# EAGLE design usb-helper (EAGLE 7.4.0)
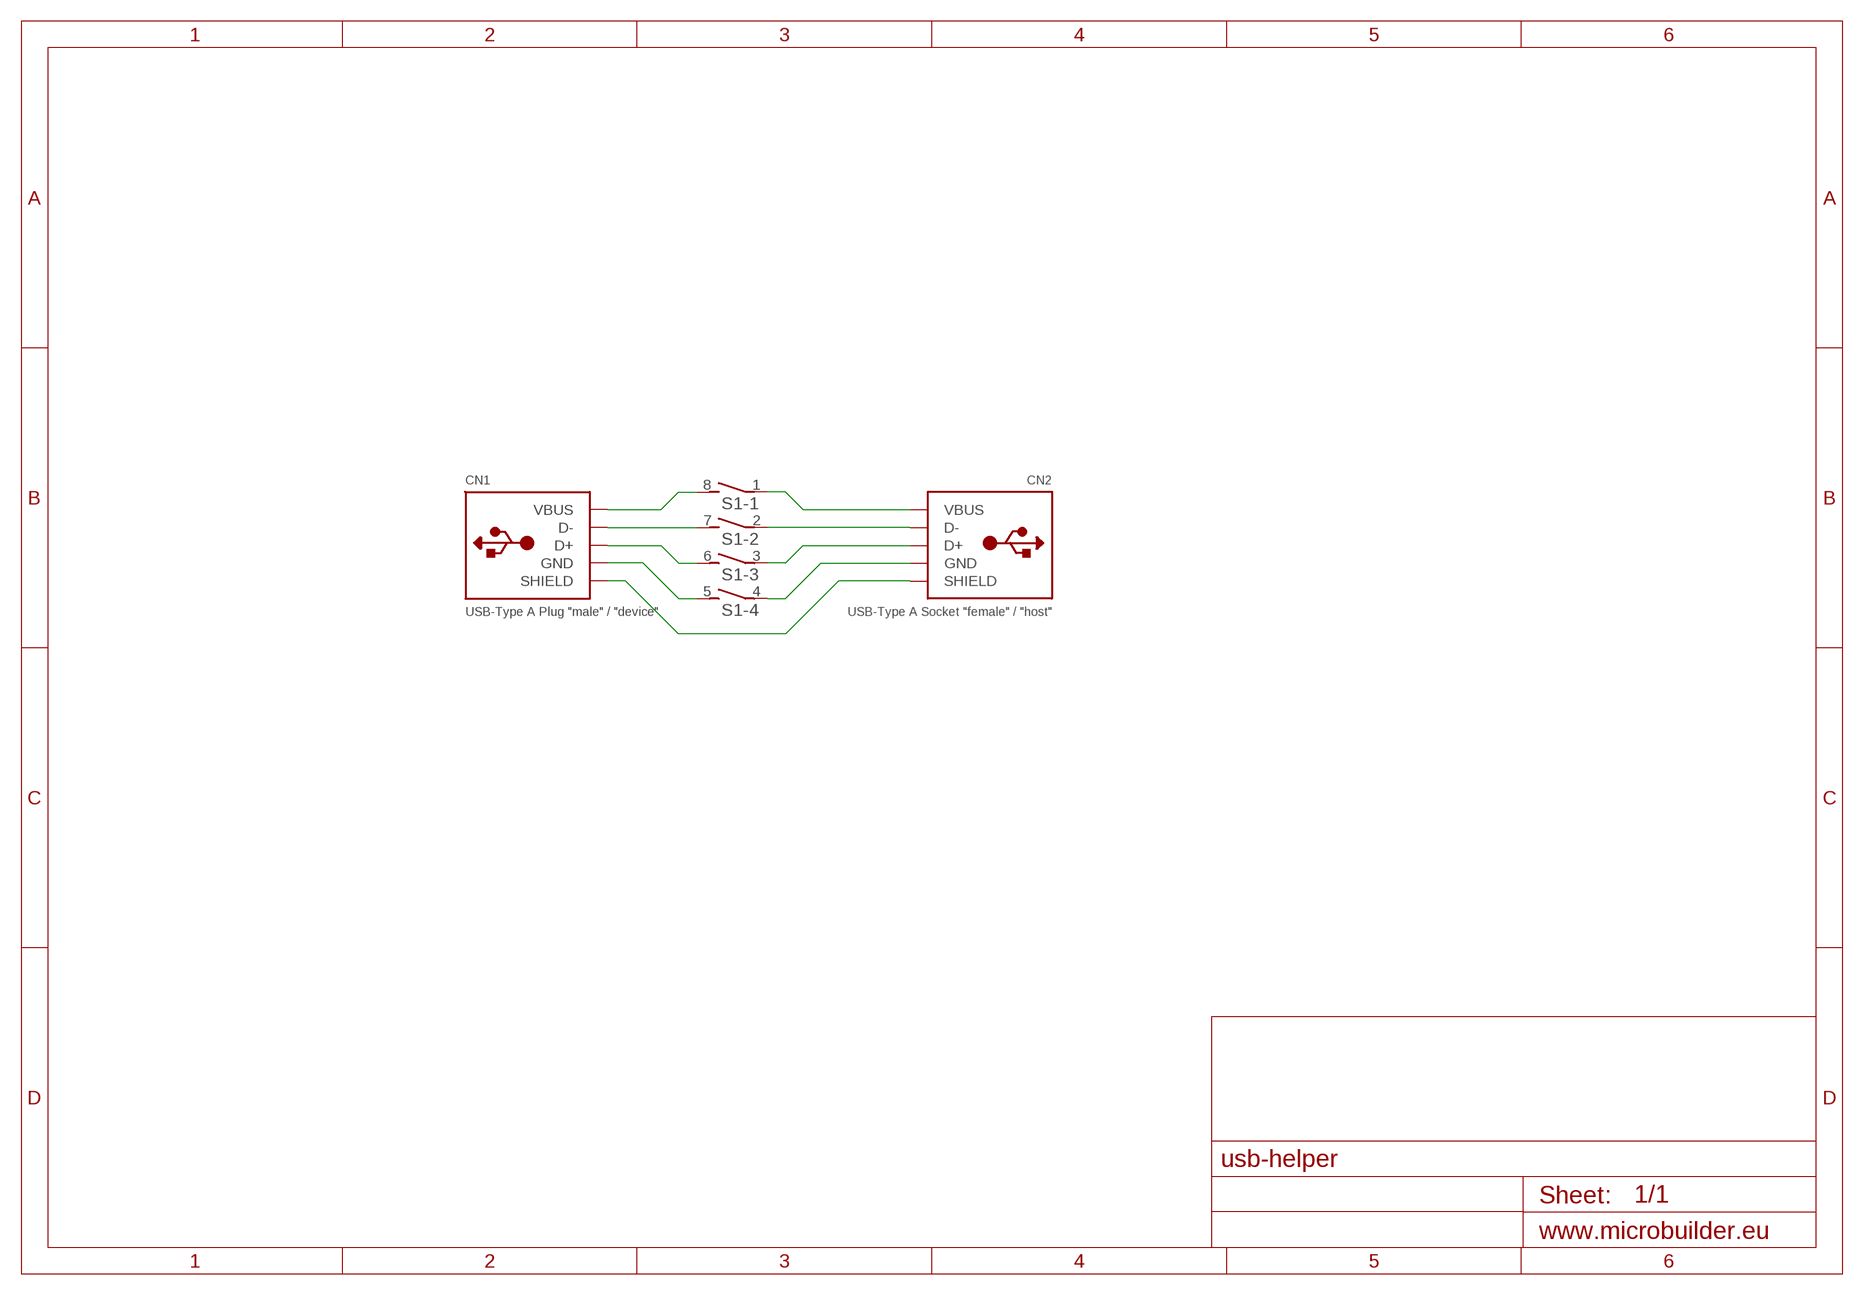
[diagram p0: schematic, sheet 1]

## Parts
CN1  USB-Type A Plug "male" / "device"  USB_TYPE_ATHT  [USB_PLUG_A_THT_AWF]
CN2  USB-Type A Socket "female" / "host"  USB_TYPE_A  [USB_SOCKET_A_THT_AW]
S1  DIP04S_SECME  [DIP_04_SECME_THT]

## Nets
D+: CN1.D+ S1.6
D+_S: CN2.D+ S1.3
D-: CN1.D- S1.7
D-_S: CN2.D- S1.2
GND: CN1.GND S1.5
GND_S: CN2.GND S1.4
SHIELD: CN1.SHIELD1(SHIELD) CN1.SHIELD2(SHIELD) CN2.S1(SHIELD) CN2.S2(SHIELD)
VBUS: CN1.VBUS S1.8
VBUS_S: CN2.VBUS S1.1

## Library data of the parts
CN1 CN2 = 00_Dirks:USB_TYPE_A: USB - Type A Connectors Male types stick out and are inserted into a PC or matching females parts (these are the connectors used on USB Memory Sticks, etc.). Female parts are generally used for USB Host and accept a male-type connector. SMT Male - 4UCON: 10017 PTH Female - Digikey: 609-1045-ND, 4UCon: 05241
S1 = 00_Dirks:DIP04S: DIL/CODE SWITCH

## Board
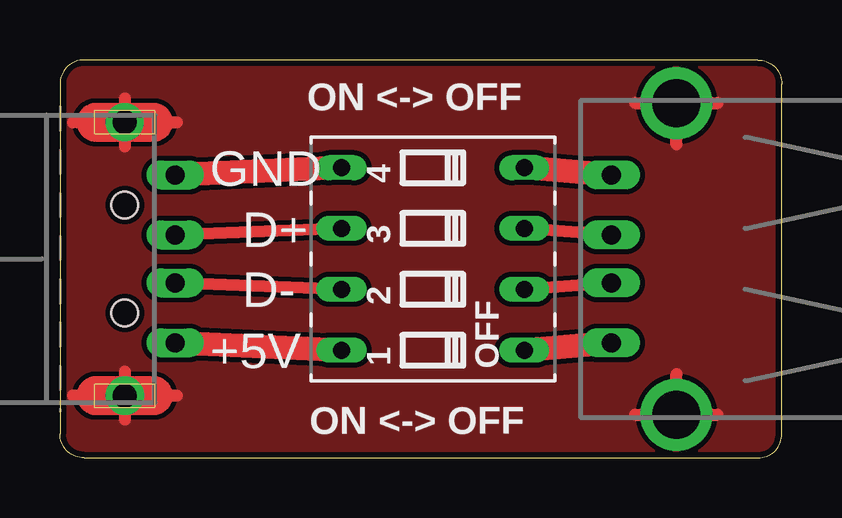
[diagram p1: board, top side]
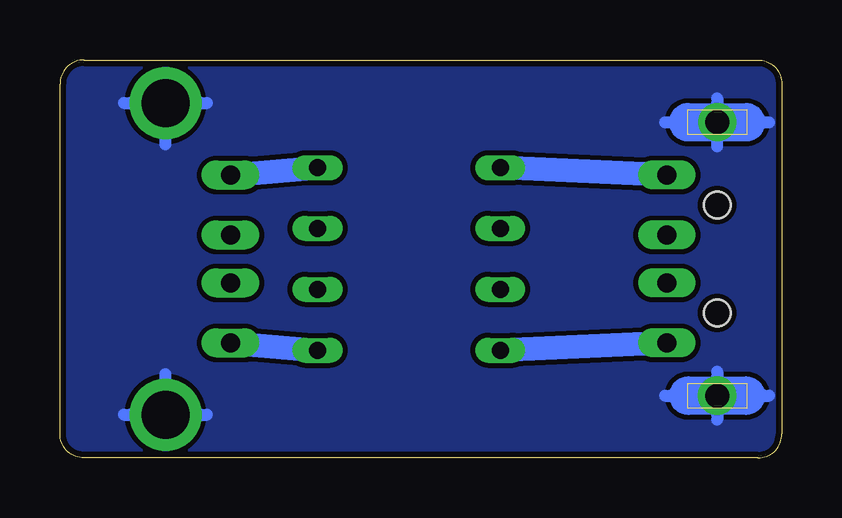
[diagram p2: board, bottom side, seen from below]

Size 30.1 x 16.6 mm. Coordinates in mm from the lower left corner, seen from the top.
Outline: 30.1,1 30.1,15.6 arc90 29.1,16.6 1,16.6 arc90 0,15.6 0,1 arc90 1,0 29.1,0 arc90 30.1,1
Copper layers (1*16): Top 0.018mm / dielectric 1.55mm / Bottom 0.018mm
Design rules "eC_2Layer_PClass6_BaseCopperO18_eCDefault_0.25mm_drills": minimum track width 0.15mm, minimum drill 0.25mm, track to track 0.15mm, track to pad 0.15mm, pad to pad 0.15mm, via to via 0.15mm, smd to smd 0mil, copper to edge 0.25mm, drill to drill 0.35mm, minimum pad ring 0.175mm, minimum via ring 0.125mm, stop-mask expansion 0mil, vias tented up to drill 0.45mm, thermal gap 0.2mm

### Footprints (pad centres in the part's own frame; a part is rotated, then mirrored left to right if it is on the bottom)
USB_PLUG_A_THT_AWF = drill 0.8 long: D+ 2.1,1; D- 2.1,-1; GND 2.1,3.5; VBUS 2.1,-3.5 | drill 1 pad 1.59: SHIELD1 0,5.7 | drill 1 pad 1.6: SHIELD2 0,-5.7 | hole 1.1: 0,2.25; 0,-2.25
USB_SOCKET_A_THT_AW = drill 0.8 long: D+ 1,2.71; D- -1,2.71; GND 3.5,2.71; VBUS -3.5,2.71 | drill 2: S1 -6.5,0; S2 6.5,0
DIP_04_SECME_THT = drill 0.7 long: 1 -3.81,-3.81; 2 -1.27,-3.81; 3 1.27,-3.81; 4 3.81,-3.81; 5 3.81,3.81; 6 1.27,3.81; 7 -1.27,3.81; 8 -3.81,3.81

### Placement (x,y rotation side)
CN1  2.7,8.3 0 top
CN2  25.7,8.3 90 top
S1  15.55,8.3 90 top

### Tracks (layer width: path | path; a pad name or v marks a point on that pad's centre or on a via)
D+
  Top 0.5: S1.6 CN1.D+
D+_S
  Top 0.5: CN2.D+ S1.3
D-
  Top 0.5: S1.7 CN1.D-
D-_S
  Top 0.5: CN2.D- S1.2
GND
  Top 1: S1.5 CN1.GND
  Bottom 1: CN1.GND S1.5
GND_S
  Top 1: CN2.GND S1.4
  Bottom 1: CN2.GND S1.4
SHIELD
  Top 0.5: 4.87,2.6 4.67,2.6 | 0.73,2.6 0.54,2.6 | 2.7,3.6 2.7,3.4 | 2.7,1.8 2.7,1.6 | 2.7,15 2.7,14.8 | 2.7,13.2 2.7,13 | 4.67,14 4.87,14 | 0.73,14 0.54,14 | 23.98,14.8 24.23,14.8 | 27.18,14.8 27.43,14.8 | 25.7,13.07 25.7,13.32 | 25.7,3.25 25.7,3.5 | 23.98,1.8 24.23,1.8 | 27.18,1.8 27.43,1.8
  Bottom 0.5: 2.7,15 2.7,14.8 | 2.7,13 2.7,13.2 | 4.87,14 4.67,14 | 0.73,14 0.54,14 | 4.87,2.6 4.67,2.6 | 0.73,2.6 0.54,2.6 | 2.7,3.6 2.7,3.4 | 2.7,1.8 2.7,1.6 | 24.23,14.8 23.98,14.8 | 27.43,14.8 27.18,14.8 | 25.7,13.07 25.7,13.32 | 25.7,3.25 25.7,3.5 | 27.43,1.8 27.18,1.8 | 24.23,1.8 23.98,1.8
  pour Bottom (isolate 0.2): 0,16.6 0,0 30.1,0 30.1,16.6
  pour Top (isolate 0.2): 0,16.6 30.1,16.6 30.1,0 0,0
VBUS
  Top 1: S1.8 CN1.VBUS
  Bottom 1: CN1.VBUS S1.8
VBUS_S
  Top 1: CN2.VBUS S1.1
  Bottom 1: CN2.VBUS S1.1

### Text on the board
tNames: ON <-> OFF | GND | D+ | D- | +5V | ON <-> OFF